# Altium schematic sheet ESP-WROOM32.SchDoc (part 2 of 3)
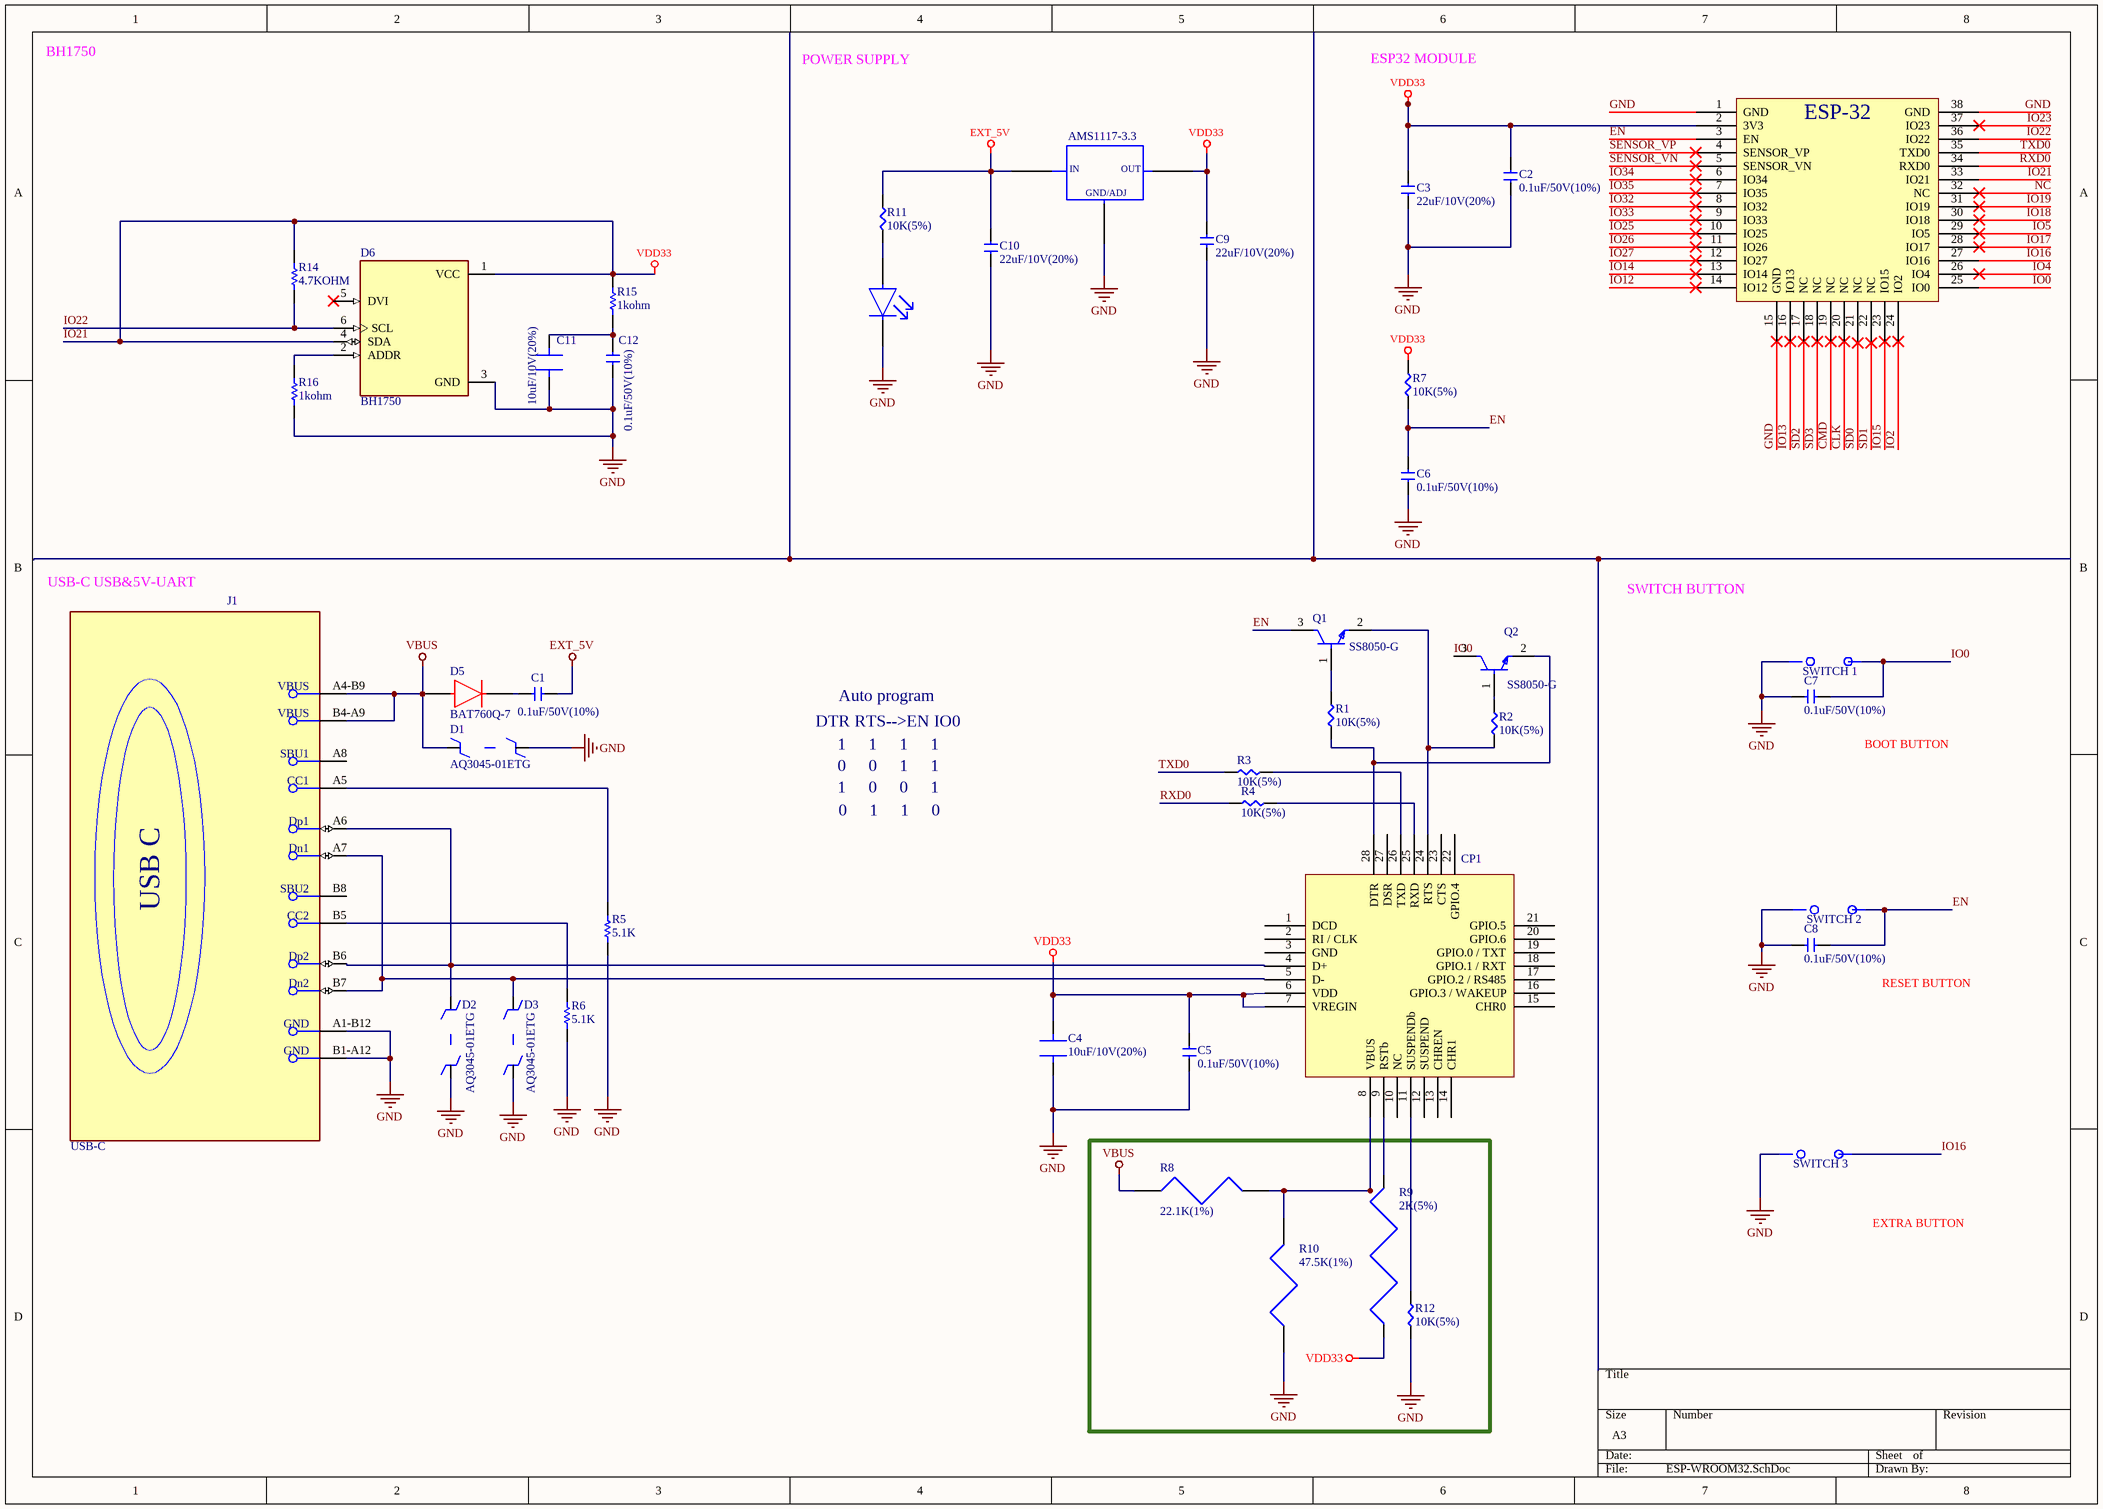
[diagram p1: ESP-WROOM32.SchDoc]
## Library data of the parts
*1 = ESP32-WROOM-32E-N4: RF TXRX MOD BT WIFI TH SMD; Manufacturer: Espressif Systems; Max Supply Voltage: 3.6V; Min Supply Voltage: 3V; Operating Supply Voltage: 3.3V; Supplier: DigiKey; Supplier Part Number: 1965-ESP32-WROOM-32E-N4CT-ND; Manufacturer Part Number: ESP32-WROOM-32E-N4; RoHS: Compliant; Category: System on Chip (SoC); Stock: 16186; Pricing: 1=4.84, 10=4.189, 25=3.9612, 100=3.649, 250=3.46184 (USD); Height - Seated (Max): 3.25mm; Length: 25.5mm; Max Operating Temperature: 85°C; Min Operating Temperature: -40°C; Number of Terminals: 38; Terminal Pitch: 1.27mm; Width: 18mm; ComponentLink1URL: https://datasheet.octopart.com:443/ESP32-WROOM-32E-N4-Espressif-Systems-datasheet-182247776.pdf?src-supplier=IHS; ComponentLink1Description: https://datasheet.octopart.com:443/ESP32-WROOM-32E-N4-Espressif-Systems-datasheet-182247776.pdf?src-supplier=IHS; ComponentLink2URL: https://datasheet.octopart.com:443/ESP32-WROOM-32E-N4-Espressif-Systems-datasheet-188867343.pdf?src-supplier=TME; ComponentLink2Description: https://datasheet.octopart.com:443/ESP32-WROOM-32E-N4-Espressif-Systems-datasheet-188867343.pdf?src-supplier=TME; ComponentLink3URL: https://datasheet.octopart.com:443/ESP32-WROOM-32E-N4-Espressif-Systems-datasheet-165560559.pdf?src-supplier=TME; ComponentLink3Description: https://datasheet.octopart.com:443/ESP32-WROOM-32E-N4-Espressif-Systems-datasheet-165560559.pdf?src-supplier=TME; ComponentLink4URL: https://datasheet.octopart.com:443/ESP32-WROOM-32E-N4-Espressif-Systems-datasheet-151884363.pdf?src-supplier=Future+Electronics; ComponentLink4Description: https://datasheet.octopart.com:443/ESP32-WROOM-32E-N4-Espressif-Systems-datasheet-151884363.pdf?src-supplier=Future+Electronics; LCSC part number: C701341
C1 C2 C5-C8 C12 = CL05B104KB5NNWC: CAP CER 0.1UF 50V X7R 0402; Manufacturer: Samsung Electro-Mechanics; Value: 100nF; Dielectric Material: Ceramic; Supplier: DigiKey; Supplier Part Number: 1276-CL05B104KB5NNWCCT-ND; Manufacturer Part Number: CL05B104KB5NNWC; RoHS: Compliant; Category: Ceramic Capacitors; Stock: 89724; Pricing: 1=0.1, 10=0.054, 50=0.037, 100=0.0319, 500=0.02338, 1000=0.02075, 2500=0.018, 5000=0.01634 (USD); China RoHS: Compliant; Lifecycle Status: Production; Max Operating Temperature: 125°C; Min Operating Temperature: -55°C; Mounting Technology: Surface Mount; Number of Terminals: 2; REACH SVHC: Yes; Schedule B: 8532240020, 8532240020|8532240020|8532240020|8532240020|8532240020; Voltage Rating (DC): 50V; ComponentLink1URL: https://datasheet.octopart.com:443/CL05B104KB5NNWC-Samsung-Electro-Mechanics-datasheet-182018729.pdf?src-supplier=IHS; ComponentLink1Description: https://datasheet.octopart.com:443/CL05B104KB5NNWC-Samsung-Electro-Mechanics-datasheet-182018729.pdf?src-supplier=IHS; LCSC part number: C7229230
C3 C9 C10 = GRM158R61A226ME15D: CAP CER 22UF 10V X5R 0402; Manufacturer: Murata; Manufacturer Lifecycle Status: IN PRODUCTION; Value: 22µF; Dielectric Material: Ceramic; Supplier: DigiKey; Supplier Part Number: 490-GRM158R61A226ME15DCT-ND; Manufacturer Part Number: GRM158R61A226ME15D; RoHS: Compliant; Category: Ceramic Capacitors; Stock: 340623; Pricing: 1=0.41, 10=0.247, 50=0.1828, 100=0.1632, 500=0.1301, 1000=0.1199, 2500=0.10912 (USD); Case/Package: 0402; Dielectric: X5R; Height: 800µm; Length: 1mm; Lifecycle Status: Production; Material: Ceramic; Max Operating Temperature: 85°C; Min Operating Temperature: -55°C; Mounting Technology: Surface Mount; Number of Terminals: 2; REACH SVHC: Yes; Thickness: 800µm; Tolerance: 20%; Voltage Rating: 10V; Voltage Rating (DC): 10V; Width: 500µm; ComponentLink1URL: https://datasheet.octopart.com:443/GRM158R61A226ME15D-Murata-datasheet-165579666.pdf?src-supplier=TME; ComponentLink1Description: https://datasheet.octopart.com:443/GRM158R61A226ME15D-Murata-datasheet-165579666.pdf?src-supplier=TME; ComponentLink2URL: https://datasheet.octopart.com/GRM158R61A226ME15D-Murata-datasheet-12515295.pdf; ComponentLink2Description: https://datasheet.octopart.com/GRM158R61A226ME15D-Murata-datasheet-12515295.pdf; ComponentLink3URL: https://datasheet.octopart.com/GRM158R61A226ME15D-Murata-datasheet-12510076.pdf; ComponentLink3Description: https://datasheet.octopart.com/GRM158R61A226ME15D-Murata-datasheet-12510076.pdf; ComponentLink4URL: https://datasheet.octopart.com/GRM158R61A226ME15D-Murata-datasheet-11978611.pdf; ComponentLink4Description: https://datasheet.octopart.com/GRM158R61A226ME15D-Murata-datasheet-11978611.pdf; ComponentLink5URL: https://datasheet.octopart.com/GRM158R61A226ME15D-Murata-datasheet-10025737.pdf; ComponentLink5Description: https://datasheet.octopart.com/GRM158R61A226ME15D-Murata-datasheet-10025737.pdf; ComponentLink6URL: https://datasheet.octopart.com/GRM158R61A226ME15D-Murata-datasheet-8819587.pdf; ComponentLink6Description: https://datasheet.octopart.com/GRM158R61A226ME15D-Murata-datasheet-8819587.pdf; ComponentLink7URL: http://sigma.octopart.com:80/reach_statement/Murata-company-16.pdf?src-supplier=Compliance+Statements; ComponentLink7Description: http://sigma.octopart.com:80/reach_statement/Murata-company-16.pdf?src-supplier=Compliance+Statements; LCSC part number: C3845593
C4 C11 = CC0402MRX5R6BB106: CAP CER 10UF 10V X5R 0402; Manufacturer: Yageo Group; Value: 10µF; Dielectric Material: Ceramic; Supplier: DigiKey; Supplier Part Number: 13-CC0402MRX5R6BB106CT-ND; Manufacturer Part Number: CC0402MRX5R6BB106; RoHS: Compliant; Category: Ceramic Capacitors; Stock: 59624; Pricing: 1=0.21, 10=0.121, 50=0.0866, 100=0.076, 500=0.05824, 1000=0.05277, 2500=0.04701, 5000=0.04354 (USD); Case/Package: 0402; China RoHS: Compliant; Dielectric: X5R; Halogen Free: Halogen Free; Height: 500µm; Lead Free: Lead Free; Length: 1mm; Lifecycle Status: Production; Max Operating Temperature: 85°C; Min Operating Temperature: -55°C; Mounting Technology: Surface Mount; Number of Terminals: 2; REACH SVHC: Yes; Voltage Rating (DC): 10V; Width: 500µm; ComponentLink1URL: https://datasheet.octopart.com:443/CC0402MRX5R6BB106-Yageo-datasheet-170350636.pdf?src-supplier=IHS; ComponentLink1Description: https://datasheet.octopart.com:443/CC0402MRX5R6BB106-Yageo-datasheet-170350636.pdf?src-supplier=IHS; ComponentLink2URL: https://datasheet.octopart.com:443/CC0402MRX5R6BB106-Yageo-Group-datasheet-189192896.pdf?src-supplier=TME; ComponentLink2Description: https://datasheet.octopart.com:443/CC0402MRX5R6BB106-Yageo-Group-datasheet-189192896.pdf?src-supplier=TME; ComponentLink3URL: https://datasheet.octopart.com:443/CC0402MRX5R6BB106-Yageo-datasheet-182029486.pdf?src-supplier=Newark; ComponentLink3Description: https://datasheet.octopart.com:443/CC0402MRX5R6BB106-Yageo-datasheet-182029486.pdf?src-supplier=Newark; ComponentLink4URL: https://datasheet.octopart.com:443/CC0402MRX5R6BB106-Yageo-datasheet-158238148.pdf?src-supplier=Newark; ComponentLink4Description: https://datasheet.octopart.com:443/CC0402MRX5R6BB106-Yageo-datasheet-158238148.pdf?src-supplier=Newark; ComponentLink5URL: https://datasheet.octopart.com/CC0402MRX5R6BB106-Yageo-datasheet-86397281.pdf; ComponentLink5Description: https://datasheet.octopart.com/CC0402MRX5R6BB106-Yageo-datasheet-86397281.pdf; ComponentLink6URL: https://datasheet.octopart.com:443/CC0402MRX5R6BB106-Yageo-datasheet-175963154.pdf?src-supplier=element14+APAC; ComponentLink6Description: https://datasheet.octopart.com:443/CC0402MRX5R6BB106-Yageo-datasheet-175963154.pdf?src-supplier=element14+APAC; ComponentLink7URL: https://datasheet.octopart.com:443/CC0402MRX5R6BB106-Yageo-Group-datasheet-145016144.pdf?src-supplier=ODG+(Origin+Data+Global); ComponentLink7Description: https://datasheet.octopart.com:443/CC0402MRX5R6BB106-Yageo-Group-datasheet-145016144.pdf?src-supplier=ODG+(Origin+Data+Global); ComponentLink8URL: https://datasheet.octopart.com:443/CC0402MRX5R6BB106-Yageo-datasheet-62067349.pdf?src-supplier=Future+Electronics; ComponentLink8Description: https://datasheet.octopart.com:443/CC0402MRX5R6BB106-Yageo-datasheet-62067349.pdf?src-supplier=Future+Electronics; ComponentLink9URL: http://sigma.octopart.com:80/conflict_mineral_statement/Yageo-company-3.pdf?src-supplier=Compliance+Statements; ComponentLink9Description: http://sigma.octopart.com:80/conflict_mineral_statement/Yageo-company-3.pdf?src-supplier=Compliance+Statements; ComponentLink10URL: http://sigma.octopart.com:80/rohs_statement/Yageo-company-2.pdf?src-supplier=Compliance+Statements; ComponentLink10Description: http://sigma.octopart.com:80/rohs_statement/Yageo-company-2.pdf?src-supplier=Compliance+Statements; LCSC PART NUMBER: C962143
CP1 = CP2102N-A02-GQFN28: USB Bridge, USB to UART USB 2.0 UART Interface 28-QFN (5x5); Manufacturer: Silicon Labs; Manufacturer Lifecycle Status: FULL PRODUCTION; Data Rate: 1.5Mbps; Max Junction Temperature (Tj): 105°C; Max Supply Voltage: 3.6V; Min Supply Voltage: 3V; Number of Digital IO: 7; Number of Ports: 1; Operating Supply Voltage: 3.3V; USB Standard: USB 2.0; Supplier: DigiKey; Supplier Part Number: 336-5889-ND; Manufacturer Part Number: CP2102N-A02-GQFN28; RoHS: Compliant; Category: USB Interface ICs; Stock: 1307; Pricing: 1=4.32, 10=3.275, 73=2.78205, 146=2.66534, 292=2.56928, 511=2.50429, 1022=2.43673, 2555=2.36542 (USD); Ambient Temperature Range High: 85°C; China RoHS: Compliant; Height: 800µm; Height - Seated (Max): 800µm; Interface: UART; Length: 5mm; Lifecycle Status: Production; Max Operating Temperature: 85°C; Min Operating Temperature: -40°C; Number of Terminals: 28; REACH SVHC: Yes; Terminal Pitch: 500µm; Width: 5mm; ComponentLink1URL: https://datasheet.octopart.com:443/CP2102N-A02-GQFN28-Silicon-Labs-datasheet-138898368.pdf?src-supplier=Augswan; ComponentLink1Description: https://datasheet.octopart.com:443/CP2102N-A02-GQFN28-Silicon-Labs-datasheet-138898368.pdf?src-supplier=Augswan; ComponentLink2URL: https://datasheet.octopart.com:443/CP2102N-A02-GQFN28-Silicon-Labs-datasheet-166051788.pdf?src-supplier=IHS; ComponentLink2Description: https://datasheet.octopart.com:443/CP2102N-A02-GQFN28-Silicon-Labs-datasheet-166051788.pdf?src-supplier=IHS; LCSC PART NUMBER: C964632
D1-D3 = AQ3045-01ETG: TVS DIODE 5.3VWM 12VC SOD882; Manufacturer: Littelfuse; Breakdown Voltage: 7.8V; Clamping Voltage: 12V; Leakage Current: 100nA; Max Breakdown Voltage: 9V; Min Breakdown Voltage: 6.8V; Number of Channels: 1; Operating Supply Voltage: 5.3V; Peak Pulse Power: 40W; Polarity: Bidirectional; Supplier: Arrow Electronics; Supplier Part Number: AQ3045-01ETG; Manufacturer Part Number: AQ3045-01ETG; RoHS: Compliant; Category: TVS Diodes; Stock: 250000; Pricing: 10000=0.1196 (USD); Lifecycle Status: Production; Max Operating Temperature: 150°C; Min Operating Temperature: -40°C; Mounting Technology: Surface Mount; Number of Elements: 1; Number of Terminals: 2; Packaging: Cut Tape; Peak Reverse Current: 100nA; REACH SVHC: Yes; Reverse Standoff Voltage: 5.3V; ComponentLink1URL: https://datasheet.octopart.com:443/AQ3045-01ETG-Littelfuse-datasheet-180606588.pdf?src-supplier=IHS; ComponentLink1Description: https://datasheet.octopart.com:443/AQ3045-01ETG-Littelfuse-datasheet-180606588.pdf?src-supplier=IHS; ComponentLink2URL: https://datasheet.octopart.com:443/AQ3045-01ETG-Littelfuse-datasheet-183003566.pdf?src-supplier=JRH+Electronics; ComponentLink2Description: https://datasheet.octopart.com:443/AQ3045-01ETG-Littelfuse-datasheet-183003566.pdf?src-supplier=JRH+Electronics; ComponentLink3URL: https://datasheet.octopart.com:443/AQ3045-01ETG-Littelfuse-datasheet-140480283.pdf?src-supplier=ODG+(Origin+Data+Global); ComponentLink3Description: https://datasheet.octopart.com:443/AQ3045-01ETG-Littelfuse-datasheet-140480283.pdf?src-supplier=ODG+(Origin+Data+Global); ComponentLink4URL: https://datasheet.octopart.com:443/AQ3045-01ETG-Littelfuse-datasheet-101609968.pdf?src-supplier=Farnell; ComponentLink4Description: https://datasheet.octopart.com:443/AQ3045-01ETG-Littelfuse-datasheet-101609968.pdf?src-supplier=Farnell; ComponentLink5URL: https://datasheet.octopart.com:443/AQ3045-01ETG-Littelfuse-datasheet-170904929.pdf?src-supplier=Future+Electronics; ComponentLink5Description: https://datasheet.octopart.com:443/AQ3045-01ETG-Littelfuse-datasheet-170904929.pdf?src-supplier=Future+Electronics; LCSC PART NUMBER: C3710326
D4 = LTST-C170GKT: LED GREEN CLEAR SMD; Manufacturer: Lite-On; Current: 4A; Dominant Wavelength: 569nm; Forward Current: 30mA; Forward Voltage: 2.6V; Lens Color: Clear, Colorless; Luminous Intensity: 6mcd; Number of Circuits: 1; Peak Wavelength: 565nm; Power Dissipation: 100mW; Reverse Voltage: 5V; Shape: Rectangular; Test Current: 10mA; Viewing Angle: 130°; Supplier: DigiKey; Supplier Part Number: 160-1179-1-ND; Manufacturer Part Number: LTST-C170GKT; RoHS: Compliant; Category: LEDs; Stock: 1226220; Pricing: 1=0.1, 10=0.066, 100=0.0453, 500=0.03552, 1000=0.03224 (USD); Case/Package: 0805; Case Code (Imperial): 0805; Case Code (Metric): 2012; China RoHS: Compliant; Color: Green; Depth: 1.25mm; Height: 1.1mm; Illumination Color: Green; Lead Free: Lead Free; Length: 2mm; Lens Transparency: Clear; Lifecycle Status: Production; Max Operating Temperature: 85°C; Min Operating Temperature: -55°C; Mounting Technology: Surface Mount; Number of Elements: 1; Number of LEDs: 1; Pins: 2; Number of Terminals: 2; Packaging: Tape and Reel; Power Rating: 100mW; Radiation Hardening: No; REACH SVHC: Yes; Schedule B: 8541402000, 8541402000|8541402000|8541402000|8541402000|8541402000|8541402000|8541402000|8541402000|8541402000|8541402000|8541402000|8541402000|8541402000|8541402000|8541402000|8541402000|8541402000|8541402000|8541402000|8541402000|8541402000|8541402000|8541402000|85; Terminal Pitch: 2.1mm; Voltage: 5V; Wavelength: 569nm; Width: 1.25mm; ComponentLink1URL: https://datasheet.octopart.com:443/LTST-C170GKT-Lite-On-datasheet-180605137.pdf?src-supplier=IHS; ComponentLink1Description: https://datasheet.octopart.com:443/LTST-C170GKT-Lite-On-datasheet-180605137.pdf?src-supplier=IHS; ComponentLink2URL: https://datasheet.octopart.com:443/LTST-C170GKT-Lite-On-datasheet-141439001.pdf?src-supplier=Upverter; ComponentLink2Description: https://datasheet.octopart.com:443/LTST-C170GKT-Lite-On-datasheet-141439001.pdf?src-supplier=Upverter; ComponentLink3URL: https://datasheet.octopart.com:443/LTST-C170GKT-Lite-On-datasheet-159307.pdf?src-supplier=Arrow+Electronics; ComponentLink3Description: https://datasheet.octopart.com:443/LTST-C170GKT-Lite-On-datasheet-159307.pdf?src-supplier=Arrow+Electronics; ComponentLink4URL: https://datasheet.octopart.com:443/LTST-C170GKT-Lite-On-datasheet-8330158.pdf?src-supplier=TME; ComponentLink4Description: https://datasheet.octopart.com:443/LTST-C170GKT-Lite-On-datasheet-8330158.pdf?src-supplier=TME; ComponentLink5URL: https://datasheet.octopart.com:443/LTST-C170GKT-Lite-On-datasheet-26684672.pdf?src-supplier=Future+Electronics; ComponentLink5Description: https://datasheet.octopart.com:443/LTST-C170GKT-Lite-On-datasheet-26684672.pdf?src-supplier=Future+Electronics; ComponentLink6URL: https://datasheet.octopart.com:443/LTST-C170GKT-Lite-On-datasheet-59241.pdf?src-supplier=DigiKey; ComponentLink6Description: https://datasheet.octopart.com:443/LTST-C170GKT-Lite-On-datasheet-59241.pdf?src-supplier=DigiKey; ComponentLink7URL: https://datasheet.octopart.com:443/LTST-C170GKT-Lite-On-datasheet-14174986.pdf?src-supplier=iiiC; ComponentLink7Description: https://datasheet.octopart.com:443/LTST-C170GKT-Lite-On-datasheet-14174986.pdf?src-supplier=iiiC; LCSC PART NUMBER: C125090
D5 = BAT760Q-7: DIODE SCHOTTKY 30V 1A SOD323; Manufacturer: Diodes Inc.; Max Forward Surge Current (Ifsm): 5.5A; Max Power Dissipation: 235mW; Number of Elements: 1; Supplier: DigiKey; Supplier Part Number: BAT760Q-7DICT-ND; Manufacturer Part Number: BAT760Q-7; RoHS: Compliant; Category: Schottky Diodes; Stock: 16229; Pricing: 1=0.3, 10=0.205, 100=0.1688, 500=0.12602, 1000=0.11219 (USD); Average Rectified Current: 1A; China RoHS: Compliant; Lifecycle Status: Production; Max Operating Temperature: 150°C; Max Output current: 1A; Max Reverse Voltage (DC): 30V; Min Operating Temperature: -65°C; Mounting Technology: Surface Mount; Number of Terminals: 2; REACH SVHC: Yes; Reverse Standoff Voltage: 30V; Schedule B: 8541100080, 8541100080|8541100080|8541100080|8541100080|8541100080; ComponentLink1URL: https://datasheet.octopart.com:443/BAT760Q-7-Diodes-Inc.-datasheet-151209907.pdf?src-supplier=IHS; ComponentLink1Description: https://datasheet.octopart.com:443/BAT760Q-7-Diodes-Inc.-datasheet-151209907.pdf?src-supplier=IHS; ComponentLink2URL: https://sigma.octopart.com:443/138810740/technical_drawing/Diodes-Inc.-BAT760Q-7.pdf?src-supplier=Diodes+Inc+SCT; ComponentLink2Description: https://sigma.octopart.com:443/138810740/technical_drawing/Diodes-Inc.-BAT760Q-7.pdf?src-supplier=Diodes+Inc+SCT; lcsc part number: C3759252
D6 = BH1750FVI-TR: SENSOR OPT 560NM AMBIENT 6WSOF; Manufacturer: ROHM; Interface: I2C, Serial; Clock Frequency: 400kHz; Max Power Dissipation: 260mW; Max Supply Voltage: 3.6V; Min Supply Voltage: 2.4V; Number of Circuits: 1; Operating Supply Current: 120µA; Operating Supply Voltage: 3V; Output Type: Digital, I2C; Sensing Method: Optical; Type: Integrated Circuit (IC); Supplier: DigiKey; Supplier Part Number: BH1750FVICT-ND; Manufacturer Part Number: BH1750FVI-TR; RoHS: Compliant; Category: Optical Sensors; Stock: 3509; Pricing: 1=3.29, 5=2.934, 10=2.804, 25=2.648, 50=2.542, 100=2.4447, 500=2.24896, 1000=2.18484 (USD); Case/Package: SMD/SMT; Contact Plating: Copper, Tin; Height: 750µm; Height - Seated (Max): 750µm; Lead Free: Lead Free; Length: 2.6mm; Lifecycle Status: Obsolete; Max Operating Temperature: 85°C; Min Operating Temperature: -40°C; Mounting Technology: Surface Mount; Pins: 6; Number of Terminals: 6; Radiation Hardening: No; REACH SVHC: Yes; Schedule B: 8541409500; Terminal Pitch: 500µm; Wavelength: 560nm; Width: 1.6mm; ComponentLink1URL: https://sigma.octopart.com:443/169791153/technical_drawing/ROHM-BH1750FVI-TR.pdf?src-supplier=Upverter; ComponentLink1Description: https://sigma.octopart.com:443/169791153/technical_drawing/ROHM-BH1750FVI-TR.pdf?src-supplier=Upverter; ComponentLink2URL: https://datasheet.octopart.com:443/BH1750FVI-TR-Rohm-datasheet-141422541.pdf?src-supplier=Upverter; ComponentLink2Description: https://datasheet.octopart.com:443/BH1750FVI-TR-Rohm-datasheet-141422541.pdf?src-supplier=Upverter; ComponentLink3URL: https://datasheet.octopart.com:443/BH1750FVI-TR-ROHM-datasheet-169791149.pdf?src-supplier=Upverter; ComponentLink3Description: https://datasheet.octopart.com:443/BH1750FVI-TR-ROHM-datasheet-169791149.pdf?src-supplier=Upverter; ComponentLink4URL: https://datasheet.octopart.com:443/BH1750FVI-TR-Rohm-datasheet-25365051.pdf?src-supplier=Newark; ComponentLink4Description: https://datasheet.octopart.com:443/BH1750FVI-TR-Rohm-datasheet-25365051.pdf?src-supplier=Newark; ComponentLink5URL: https://datasheet.octopart.com:443/BH1750FVI-TR-Rohm-datasheet-8331172.pdf?src-supplier=_legacy+Avnet; ComponentLink5Description: https://datasheet.octopart.com:443/BH1750FVI-TR-Rohm-datasheet-8331172.pdf?src-supplier=_legacy+Avnet; ComponentLink6URL: https://datasheet.octopart.com:443/BH1750FVI-TR-Rohm-datasheet-145014626.pdf?src-supplier=Future+Electronics; ComponentLink6Description: https://datasheet.octopart.com:443/BH1750FVI-TR-Rohm-datasheet-145014626.pdf?src-supplier=Future+Electronics; ComponentLink7URL: https://datasheet.octopart.com:443/BH1750FVI-TR-Rohm-datasheet-14434783.pdf?src-supplier=Factory+Futures; ComponentLink7Description: https://datasheet.octopart.com:443/BH1750FVI-TR-Rohm-datasheet-14434783.pdf?src-supplier=Factory+Futures; LCSC PART NUMBER: C78960
J1 = 2171790001: CONN RCP USB2.0 TYP C 24P SMD RA; Manufacturer: Molex; Manufacturer Part Number: 217179-0001; Contact Resistance: 50mΩ; Current Rating: 1.25A; Dielectric Material: Polyamide; Gender: Receptacle; Insulation Resistance: 100MΩ; Number of Contacts: 16; Number of Ports: 1; Voltage Rating: 30V; Supplier: DigiKey; Supplier Part Number: 900-2171790001CT-ND; RoHS: Compliant; Category: USB Connectors; Stock: 5295; Pricing: 1=0.83, 10=0.704, 25=0.6596, 50=0.628, 100=0.598, 250=0.56052, 500=0.53374 (USD); Contact Gender: Female; Contact Material: Gold, Nickel; Height: 3.36mm; Lifecycle Status: Production; Max Operating Temperature: 85°C; Min Operating Temperature: -40°C; Pins: 16; Number of Rows: 1; REACH SVHC: Yes; Shell Finish: Nickel; Shell Material: Stainless Steel; Terminal Pitch: 500µm; USB Standard: USB 2.0; ComponentLink1URL: https://datasheet.octopart.com:443/217179-0001-Molex-datasheet-158871109.pdf?src-supplier=ODG+(Origin+Data+Global); ComponentLink1Description: https://datasheet.octopart.com:443/217179-0001-Molex-datasheet-158871109.pdf?src-supplier=ODG+(Origin+Data+Global); ComponentLink2URL: https://sigma.octopart.com:443/158871110/technical_drawing/Molex-217179-0001.pdf?src-supplier=Upverter; ComponentLink2Description: https://sigma.octopart.com:443/158871110/technical_drawing/Molex-217179-0001.pdf?src-supplier=Upverter; ComponentLink3URL: https://datasheet.octopart.com:443/217179-0001-Molex-datasheet-164573281.pdf?src-supplier=RS+(Formerly+Allied+Electronics); ComponentLink3Description: https://datasheet.octopart.com:443/217179-0001-Molex-datasheet-164573281.pdf?src-supplier=RS+(Formerly+Allied+Electronics); ComponentLink4URL: http://sigma.octopart.com:80/conflict_mineral_statement/Molex-company-72.pdf?src-supplier=Compliance+Statements; ComponentLink4Description: http://sigma.octopart.com:80/conflict_mineral_statement/Molex-company-72.pdf?src-supplier=Compliance+Statements; ComponentLink5URL: http://sigma.octopart.com:80/rohs_statement/Molex-company-73.pdf?src-supplier=Compliance+Statements; ComponentLink5Description: http://sigma.octopart.com:80/rohs_statement/Molex-company-73.pdf?src-supplier=Compliance+Statements; ComponentLink6URL: http://sigma.octopart.com:80/reach_statement/Molex-company-74.pdf?src-supplier=Compliance+Statements; ComponentLink6Description: http://sigma.octopart.com:80/reach_statement/Molex-company-74.pdf?src-supplier=Compliance+Statements; LCSC PART NUMBER: C3197684
Q1 Q2 = SS8050-G: TRANS NPN 25V 1.5A SOT-23-3; Manufacturer: Comchip; Collector Base Voltage (VCBO): 40V; Collector Emitter Saturation Voltage: 500mV; Emitter Base Voltage (VEBO): 5V; hFE Min: 40; Max Junction Temperature (Tj): 150°C; Max Power Dissipation: 300mW; Number of Elements: 1; Transition Frequency: 100MHz; Supplier: DigiKey; Supplier Part Number: 641-1790-1-ND; Manufacturer Part Number: SS8050-G; RoHS: Compliant; Category: BJTs; Stock: 59487; Pricing: 1=0.24, 10=0.148, 100=0.0921, 500=0.06754, 1000=0.05958 (USD); Case/Package: TO-236-3; Collector Emitter Breakdown Voltage: 25V; Collector Emitter Voltage (VCEO): 25V; Height: 1.15mm; Lifecycle Status: Production; Max Breakdown Voltage: 25V; Max Collector Current: 1.5A; Max Operating Temperature: 150°C; Mounting Technology: Surface Mount; Number of Terminals: 3; Power Dissipation: 300mW; REACH SVHC: Yes; Schedule B: 8541100070|8541100070|8541100070|8541100070|8541100070; ComponentLink1URL: https://datasheet.octopart.com:443/SS8050-G-Comchip-datasheet-180131983.pdf?src-supplier=IHS; ComponentLink1Description: https://datasheet.octopart.com:443/SS8050-G-Comchip-datasheet-180131983.pdf?src-supplier=IHS; ComponentLink2URL: https://datasheet.octopart.com:443/SS8050-G-Comchip-datasheet-155422643.pdf?src-supplier=Upverter; ComponentLink2Description: https://datasheet.octopart.com:443/SS8050-G-Comchip-datasheet-155422643.pdf?src-supplier=Upverter; ComponentLink3URL: https://datasheet.octopart.com:443/SS8050-G-Comchip-datasheet-189767092.pdf?src-supplier=ODG+(Origin+Data+Global); ComponentLink3Description: https://datasheet.octopart.com:443/SS8050-G-Comchip-datasheet-189767092.pdf?src-supplier=ODG+(Origin+Data+Global); LCSC PART NUMBER: C164886
R1-R4 R7 R11 R12 = RC0402JR-0710KL: RES 10K OHM 5% 1/16W 0402; Manufacturer: Yageo Group; Max Power Dissipation: 63mW; Power Dissipation: 62.5mW; Value: 10kΩ; Temperature Coefficient: 100ppm/°C; Voltage Rating: 50V; Supplier: DigiKey; Supplier Part Number: 311-10KJRCT-ND; Manufacturer Part Number: RC0402JR-0710KL; RoHS: Compliant; Category: Chip SMD Resistors; Stock: 11539169; Pricing: 1=0.1, 10=0.006, 25=0.0056, 50=0.0052, 100=0.0046, 250=0.00416, 500=0.00284 (USD); Case/Package: 0402; Case Code (Imperial): 0402; China RoHS: Non-Compliant; Composition: Thick Film; Depth: 500µm; Features: Moisture Resistant; Height: 350µm; Lead Free: Lead Free; Length: 1mm; Lifecycle Status: Production; Max Operating Temperature: 155°C; Military Standard: Not; Min Operating Temperature: -55°C; Mounting Technology: Surface Mount; Pins: 2; Number of Terminals: 2; Number of Terminations: 2; Packaging: Tape & Reel; Power Rating: 62.5mW; REACH SVHC: Yes; Schedule B: 8533210045, 8533210045|8533210045, 8533210045|8533210045|8533210045, 8533210045|8533210045|8533210045|8533210045; Termination: SMD/SMT; Tolerance: 5%; Voltage Rating (AC): 50V; Voltage Rating (DC): 50V; Width: 500µm; Working Voltage: 50V; ComponentLink1URL: https://datasheet.octopart.com:443/RC0402JR-0710KL-Yageo-datasheet-175887523.pdf?src-supplier=IHS; ComponentLink1Description: https://datasheet.octopart.com:443/RC0402JR-0710KL-Yageo-datasheet-175887523.pdf?src-supplier=IHS; ComponentLink2URL: https://datasheet.octopart.com:443/RC0402JR-0710KL-Yageo-datasheet-10408619.pdf?src-supplier=Newark; ComponentLink2Description: https://datasheet.octopart.com:443/RC0402JR-0710KL-Yageo-datasheet-10408619.pdf?src-supplier=Newark; ComponentLink3URL: https://datasheet.octopart.com:443/RC0402JR-0710KL-Yageo-datasheet-505231.pdf?src-supplier=Newark; ComponentLink3Description: https://datasheet.octopart.com:443/RC0402JR-0710KL-Yageo-datasheet-505231.pdf?src-supplier=Newark; ComponentLink4URL: https://datasheet.octopart.com:443/RC0402JR-0710KL-Yageo-datasheet-141265859.pdf?src-supplier=Upverter; ComponentLink4Description: https://datasheet.octopart.com:443/RC0402JR-0710KL-Yageo-datasheet-141265859.pdf?src-supplier=Upverter; ComponentLink5URL: https://sigma.octopart.com:443/138820526/technical_drawing/Yageo-RC0402JR-0710KL.pdf?src-supplier=Upverter; ComponentLink5Description: https://sigma.octopart.com:443/138820526/technical_drawing/Yageo-RC0402JR-0710KL.pdf?src-supplier=Upverter; ComponentLink6URL: https://datasheet.octopart.com:443/RC0402JR-0710KL-Yageo-datasheet-62067350.pdf?src-supplier=Farnell; ComponentLink6Description: https://datasheet.octopart.com:443/RC0402JR-0710KL-Yageo-datasheet-62067350.pdf?src-supplier=Farnell; ComponentLink7URL: https://datasheet.octopart.com:443/RC0402JR-0710KL-Yageo-datasheet-12531192.pdf?src-supplier=Seeed+Studio; ComponentLink7Description: https://datasheet.octopart.com:443/RC0402JR-0710KL-Yageo-datasheet-12531192.pdf?src-supplier=Seeed+Studio; ComponentLink8URL: https://datasheet.octopart.com:443/RC0402JR-0710KL-Yageo-datasheet-8324527.pdf?src-supplier=TME; ComponentLink8Description: https://datasheet.octopart.com:443/RC0402JR-0710KL-Yageo-datasheet-8324527.pdf?src-supplier=TME; ComponentLink9URL: https://datasheet.octopart.com:443/RC0402JR-0710KL-Yageo-datasheet-164759695.pdf?src-supplier=Future+Electronics; ComponentLink9Description: https://datasheet.octopart.com:443/RC0402JR-0710KL-Yageo-datasheet-164759695.pdf?src-supplier=Future+Electronics; ComponentLink10URL: https://datasheet.octopart.com:443/RC0402JR-0710KL-Yageo-datasheet-137700087.pdf?src-supplier=Future+Electronics; ComponentLink10Description: https://datasheet.octopart.com:443/RC0402JR-0710KL-Yageo-datasheet-137700087.pdf?src-supplier=Future+Electronics; ComponentLink11URL: https://datasheet.octopart.com/RC0402JR-0710KL-Yageo-datasheet-73766026.pdf; ComponentLink11Description: https://datasheet.octopart.com/RC0402JR-0710KL-Yageo-datasheet-73766026.pdf; ComponentLink12URL: https://datasheet.octopart.com:443/RC0402JR-0710KL-Yageo-datasheet-8329306.pdf?src-supplier=element14; ComponentLink12Description: https://datasheet.octopart.com:443/RC0402JR-0710KL-Yageo-datasheet-8329306.pdf?src-supplier=element14; ComponentLink13URL: http://sigma.octopart.com:80/rohs_statement/Yageo-company-2.pdf?src-supplier=Compliance+Statements; ComponentLink13Description: http://sigma.octopart.com:80/rohs_statement/Yageo-company-2.pdf?src-supplier=Compliance+Statements; ComponentLink14URL: http://sigma.octopart.com:80/conflict_mineral_statement/Yageo-company-3.pdf?src-supplier=Compliance+Statements; ComponentLink14Description: http://sigma.octopart.com:80/conflict_mineral_statement/Yageo-company-3.pdf?src-supplier=Compliance+Statements; LCSC part number: C60489
R5 R6 = RC0402FR-075K1L: RES 5.1K OHM 1% 1/16W 0402; Manufacturer: Yageo Group; Max Power Dissipation: 63mW; Power Dissipation: 62.5mW; Value: 5.1kΩ; Temperature Coefficient: 100ppm/°C; Voltage Rating: 50V; Supplier: DigiKey; Supplier Part Number: 311-5.10KLRCT-ND; Manufacturer Part Number: RC0402FR-075K1L; RoHS: Compliant; Category: Chip SMD Resistors; Stock: 251126; Pricing: 1=0.1, 10=0.008, 25=0.0072, 50=0.0062, 100=0.0056, 250=0.00308 (USD); Case/Package: 0402; Case Code (Imperial): 0402; China RoHS: Non-Compliant; Composition: Thick Film; Depth: 500µm; Features: Moisture Resistant; Height: 350µm; Lead Free: Lead Free; Length: 1mm; Lifecycle Status: Production; Max Operating Temperature: 155°C; Military Standard: Not; Min Operating Temperature: -55°C; Mounting Technology: Surface Mount; Pins: 2; Number of Terminals: 2; Number of Terminations: 2; Packaging: Cut Tape; Power Rating: 63mW; REACH SVHC: Yes; Schedule B: 8533210045, 8533210045|8533210045, 8533210045|8533210045|8533210045, 8533210045|8533210045|8533210045|8533210045; Termination: SMD/SMT; Tolerance: 1%; Voltage Rating (DC): 50V; Width: 500µm; Working Voltage: 50V; ComponentLink1URL: https://datasheet.octopart.com:443/RC0402FR-075K1L-Yageo-datasheet-175887523.pdf?src-supplier=IHS; ComponentLink1Description: https://datasheet.octopart.com:443/RC0402FR-075K1L-Yageo-datasheet-175887523.pdf?src-supplier=IHS; ComponentLink2URL: https://datasheet.octopart.com:443/RC0402FR-075K1L-Yageo-datasheet-103092701.pdf?src-supplier=Upverter; ComponentLink2Description: https://datasheet.octopart.com:443/RC0402FR-075K1L-Yageo-datasheet-103092701.pdf?src-supplier=Upverter; ComponentLink3URL: https://datasheet.octopart.com:443/RC0402FR-075K1L-Yageo-datasheet-10408619.pdf?src-supplier=Newark; ComponentLink3Description: https://datasheet.octopart.com:443/RC0402FR-075K1L-Yageo-datasheet-10408619.pdf?src-supplier=Newark; ComponentLink4URL: https://datasheet.octopart.com:443/RC0402FR-075K1L-Yageo-datasheet-8324527.pdf?src-supplier=Newark; ComponentLink4Description: https://datasheet.octopart.com:443/RC0402FR-075K1L-Yageo-datasheet-8324527.pdf?src-supplier=Newark; ComponentLink5URL: https://datasheet.octopart.com:443/RC0402FR-075K1L-Yageo-datasheet-62067350.pdf?src-supplier=element14+APAC; ComponentLink5Description: https://datasheet.octopart.com:443/RC0402FR-075K1L-Yageo-datasheet-62067350.pdf?src-supplier=element14+APAC; ComponentLink6URL: https://datasheet.octopart.com:443/RC0402FR-075K1L-Yageo-datasheet-164759695.pdf?src-supplier=Future+Electronics; ComponentLink6Description: https://datasheet.octopart.com:443/RC0402FR-075K1L-Yageo-datasheet-164759695.pdf?src-supplier=Future+Electronics; ComponentLink7URL: https://datasheet.octopart.com:443/RC0402FR-075K1L-Yageo-datasheet-137700087.pdf?src-supplier=Future+Electronics; ComponentLink7Description: https://datasheet.octopart.com:443/RC0402FR-075K1L-Yageo-datasheet-137700087.pdf?src-supplier=Future+Electronics; ComponentLink8URL: https://datasheet.octopart.com:443/RC0402FR-075K1L-Yageo-datasheet-12531192.pdf?src-supplier=Future+Electronics; ComponentLink8Description: https://datasheet.octopart.com:443/RC0402FR-075K1L-Yageo-datasheet-12531192.pdf?src-supplier=Future+Electronics; ComponentLink9URL: https://datasheet.octopart.com:443/RC0402FR-075K1L-Yageo-datasheet-505231.pdf?src-supplier=Future+Electronics; ComponentLink9Description: https://datasheet.octopart.com:443/RC0402FR-075K1L-Yageo-datasheet-505231.pdf?src-supplier=Future+Electronics; ComponentLink10URL: https://datasheet.octopart.com:443/RC0402FR-075K1L-Yageo-datasheet-148775077.pdf?src-supplier=TME; ComponentLink10Description: https://datasheet.octopart.com:443/RC0402FR-075K1L-Yageo-datasheet-148775077.pdf?src-supplier=TME; ComponentLink11URL: https://datasheet.octopart.com/RC0402FR-075K1L-Yageo-datasheet-73766026.pdf; ComponentLink11Description: https://datasheet.octopart.com/RC0402FR-075K1L-Yageo-datasheet-73766026.pdf; ComponentLink12URL: https://datasheet.octopart.com:443/RC0402FR-075K1L-Yageo-datasheet-8329306.pdf?src-supplier=element14; ComponentLink12Description: https://datasheet.octopart.com:443/RC0402FR-075K1L-Yageo-datasheet-8329306.pdf?src-supplier=element14; ComponentLink13URL: http://sigma.octopart.com:80/rohs_statement/Yageo-company-2.pdf?src-supplier=Compliance+Statements; ComponentLink13Description: http://sigma.octopart.com:80/rohs_statement/Yageo-company-2.pdf?src-supplier=Compliance+Statements; ComponentLink14URL: http://sigma.octopart.com:80/conflict_mineral_statement/Yageo-company-3.pdf?src-supplier=Compliance+Statements; ComponentLink14Description: http://sigma.octopart.com:80/conflict_mineral_statement/Yageo-company-3.pdf?src-supplier=Compliance+Statements; LCSC PART NUMBER: C105872
R8 = AC0402FR-0722K1L: RES SMD 22.1K OHM 1% 1/16W 0402; Manufacturer: Yageo Group; Max Power Dissipation: 63mW; Power Dissipation: 62.5mW; Value: 22.1kΩ; Temperature Coefficient: 100ppm/°C; Voltage Rating: 50V; Supplier: DigiKey; Supplier Part Number: YAG3457CT-ND; Manufacturer Part Number: AC0402FR-0722K1L; RoHS: Compliant; Category: Chip SMD Resistors; Stock: 23159; Pricing: 1=0.1, 10=0.009, 25=0.008, 50=0.0072, 100=0.0066, 250=0.00408, 500=0.00406 (USD); Case/Package: 0402; Case Code (Imperial): 0402; Case Code (Metric): 1005; China RoHS: Non-Compliant; Composition: Thick Film; Features: Automotive AEC-Q200, Moisture Resistant; Height: 320µm; Length: 990.6µm; Lifecycle Status: Production; Max Operating Temperature: 155°C; Min Operating Temperature: -55°C; Mounting Technology: Surface Mount; Number of Terminals: 2; Number of Terminations: 2; Packaging: Tape & Reel; Power Rating: 62.5mW; REACH SVHC: Yes; Schedule B: 8533210045, 8533210045|8533210045|8533210045|8533210045|8533210045; Tolerance: 1%; Width: 500µm; Working Voltage: 50V; ComponentLink1URL: https://datasheet.octopart.com:443/AC0402FR-0722K1L-Yageo-datasheet-182189377.pdf?src-supplier=IHS; ComponentLink1Description: https://datasheet.octopart.com:443/AC0402FR-0722K1L-Yageo-datasheet-182189377.pdf?src-supplier=IHS; ComponentLink2URL: https://datasheet.octopart.com:443/AC0402FR-0722K1L-Yageo-datasheet-83209224.pdf?src-supplier=Upverter; ComponentLink2Description: https://datasheet.octopart.com:443/AC0402FR-0722K1L-Yageo-datasheet-83209224.pdf?src-supplier=Upverter; ComponentLink3URL: https://datasheet.octopart.com:443/AC0402FR-0722K1L-Yageo-datasheet-178509465.pdf?src-supplier=Newark; ComponentLink3Description: https://datasheet.octopart.com:443/AC0402FR-0722K1L-Yageo-datasheet-178509465.pdf?src-supplier=Newark; ComponentLink4URL: https://datasheet.octopart.com:443/AC0402FR-0722K1L-Yageo-datasheet-166720450.pdf?src-supplier=Future+Electronics; ComponentLink4Description: https://datasheet.octopart.com:443/AC0402FR-0722K1L-Yageo-datasheet-166720450.pdf?src-supplier=Future+Electronics; ComponentLink5URL: https://datasheet.octopart.com:443/AC0402FR-0722K1L-Yageo-datasheet-151884373.pdf?src-supplier=Future+Electronics; ComponentLink5Description: https://datasheet.octopart.com:443/AC0402FR-0722K1L-Yageo-datasheet-151884373.pdf?src-supplier=Future+Electronics; ComponentLink6URL: https://datasheet.octopart.com:443/AC0402FR-0722K1L-Yageo-datasheet-137699919.pdf?src-supplier=Future+Electronics; ComponentLink6Description: https://datasheet.octopart.com:443/AC0402FR-0722K1L-Yageo-datasheet-137699919.pdf?src-supplier=Future+Electronics; ComponentLink7URL: https://datasheet.octopart.com:443/AC0402FR-0722K1L-Yageo-datasheet-86786639.pdf?src-supplier=Future+Electronics; ComponentLink7Description: https://datasheet.octopart.com:443/AC0402FR-0722K1L-Yageo-datasheet-86786639.pdf?src-supplier=Future+Electronics; ComponentLink8URL: https://datasheet.octopart.com:443/AC0402FR-0722K1L-Yageo-datasheet-128677973.pdf?src-supplier=X-ON; ComponentLink8Description: https://datasheet.octopart.com:443/AC0402FR-0722K1L-Yageo-datasheet-128677973.pdf?src-supplier=X-ON; ComponentLink9URL: https://datasheet.octopart.com/AC0402FR-0722K1L-Yageo-datasheet-12512238.pdf; ComponentLink9Description: https://datasheet.octopart.com/AC0402FR-0722K1L-Yageo-datasheet-12512238.pdf; ComponentLink10URL: http://sigma.octopart.com:80/rohs_statement/Yageo-company-2.pdf?src-supplier=Compliance+Statements; ComponentLink10Description: http://sigma.octopart.com:80/rohs_statement/Yageo-company-2.pdf?src-supplier=Compliance+Statements; ComponentLink11URL: http://sigma.octopart.com:80/conflict_mineral_statement/Yageo-company-3.pdf?src-supplier=Compliance+Statements; ComponentLink11Description: http://sigma.octopart.com:80/conflict_mineral_statement/Yageo-company-3.pdf?src-supplier=Compliance+Statements; LCSC PART NUMBER: C226356
R9 = RC0402JR-072KL: RES 2K OHM 5% 1/16W 0402; Manufacturer: Yageo Group; Power Dissipation: 62.5mW; Value: 2kΩ; Temperature Coefficient: 100ppm/°C; Voltage Rating: 50V; Supplier: DigiKey; Supplier Part Number: 311-2.0KJRCT-ND; Manufacturer Part Number: RC0402JR-072KL; RoHS: Compliant; Category: Chip SMD Resistors; Stock: 102655; Pricing: 1=0.1, 10=0.006, 25=0.0056, 50=0.0052, 100=0.0046, 250=0.00416, 500=0.00284 (USD); Case/Package: 0402; Case Code (Imperial): 0402; China RoHS: Non-Compliant; Composition: Thick Film; Contact Plating: Tin; Depth: 500µm; Height: 350µm; Lead Free: Lead Free; Length: 1mm; Lifecycle Status: Production; Max Operating Temperature: 155°C; Military Standard: Not; Min Operating Temperature: -55°C; Mounting Technology: Surface Mount; Pins: 2; Number of Terminals: 2; Packaging: Tape & Reel; Power Rating: 62.5mW; Radiation Hardening: No; REACH SVHC: Yes; Schedule B: 8533210045, 8533210045|8533210045|8533210045|8533210045|8533210045; Termination: SMD/SMT; Tolerance: 5%; Voltage Rating (DC): 50V; Width: 500µm; Working Voltage: 50V; ComponentLink1URL: https://datasheet.octopart.com:443/RC0402JR-072KL-Yageo-datasheet-175887523.pdf?src-supplier=Newark; ComponentLink1Description: https://datasheet.octopart.com:443/RC0402JR-072KL-Yageo-datasheet-175887523.pdf?src-supplier=Newark; ComponentLink2URL: https://datasheet.octopart.com:443/RC0402JR-072KL-Yageo-datasheet-10408619.pdf?src-supplier=Farnell; ComponentLink2Description: https://datasheet.octopart.com:443/RC0402JR-072KL-Yageo-datasheet-10408619.pdf?src-supplier=Farnell; ComponentLink3URL: https://datasheet.octopart.com:443/RC0402JR-072KL-Yageo-datasheet-62067350.pdf?src-supplier=Farnell; ComponentLink3Description: https://datasheet.octopart.com:443/RC0402JR-072KL-Yageo-datasheet-62067350.pdf?src-supplier=Farnell; ComponentLink4URL: https://datasheet.octopart.com:443/RC0402JR-072KL-Yageo-datasheet-164759695.pdf?src-supplier=Future+Electronics; ComponentLink4Description: https://datasheet.octopart.com:443/RC0402JR-072KL-Yageo-datasheet-164759695.pdf?src-supplier=Future+Electronics; ComponentLink5URL: https://datasheet.octopart.com:443/RC0402JR-072KL-Yageo-datasheet-137700087.pdf?src-supplier=Future+Electronics; ComponentLink5Description: https://datasheet.octopart.com:443/RC0402JR-072KL-Yageo-datasheet-137700087.pdf?src-supplier=Future+Electronics; ComponentLink6URL: https://datasheet.octopart.com:443/RC0402JR-072KL-Yageo-datasheet-12531192.pdf?src-supplier=Future+Electronics; ComponentLink6Description: https://datasheet.octopart.com:443/RC0402JR-072KL-Yageo-datasheet-12531192.pdf?src-supplier=Future+Electronics; ComponentLink7URL: https://datasheet.octopart.com:443/RC0402JR-072KL-Yageo-datasheet-505231.pdf?src-supplier=Future+Electronics; ComponentLink7Description: https://datasheet.octopart.com:443/RC0402JR-072KL-Yageo-datasheet-505231.pdf?src-supplier=Future+Electronics; ComponentLink8URL: https://datasheet.octopart.com/RC0402JR-072KL-Yageo-datasheet-73766026.pdf; ComponentLink8Description: https://datasheet.octopart.com/RC0402JR-072KL-Yageo-datasheet-73766026.pdf; ComponentLink9URL: https://datasheet.octopart.com:443/RC0402JR-072KL-Yageo-datasheet-8329306.pdf?src-supplier=element14; ComponentLink9Description: https://datasheet.octopart.com:443/RC0402JR-072KL-Yageo-datasheet-8329306.pdf?src-supplier=element14; ComponentLink10URL: https://datasheet.octopart.com:443/RC0402JR-072KL-Yageo-datasheet-8324527.pdf?src-supplier=TME; ComponentLink10Description: https://datasheet.octopart.com:443/RC0402JR-072KL-Yageo-datasheet-8324527.pdf?src-supplier=TME; ComponentLink11URL: http://sigma.octopart.com:80/rohs_statement/Yageo-company-2.pdf?src-supplier=Compliance+Statements; ComponentLink11Description: http://sigma.octopart.com:80/rohs_statement/Yageo-company-2.pdf?src-supplier=Compliance+Statements; ComponentLink12URL: http://sigma.octopart.com:80/conflict_mineral_statement/Yageo-company-3.pdf?src-supplier=Compliance+Statements; ComponentLink12Description: http://sigma.octopart.com:80/conflict_mineral_statement/Yageo-company-3.pdf?src-supplier=Compliance+Statements; LCSC PART NUMBER: C137887
R10 = RC0402FR-1347K5L: RES 47.5K OHM 1% 1/16W 0402; Manufacturer: Yageo Group; Power Dissipation: 62.5mW; Value: 47.5kΩ; Temperature Coefficient: 100ppm/°C; Working Voltage: 50V; Supplier: DigiKey; Supplier Part Number: 13-RC0402FR-1347K5LCT-ND; Manufacturer Part Number: RC0402FR-1347K5L; RoHS: Compliant; Category: Chip SMD Resistors; Stock: 75939; Pricing: 1=0.1, 10=0.02, 25=0.014, 50=0.0112, 100=0.009, 250=0.00688, 500=0.00566, 1000=0.00474, 5000=0.00328 (USD); Case/Package: 0402; China RoHS: Non-Compliant; Composition: Thick Film; Contact Plating: Tin; Depth: 500µm; Height: 350µm; Length: 1mm; Lifecycle Status: Production; Max Operating Temperature: 155°C; Military Standard: Not; Min Operating Temperature: -55°C; Mounting Technology: Surface Mount; Number of Terminals: 2; REACH SVHC: Yes; Tolerance: 1%; Width: 500µm; ComponentLink1URL: https://datasheet.octopart.com:443/RC0402FR-1347K5L-Yageo-datasheet-175887523.pdf?src-supplier=IHS; ComponentLink1Description: https://datasheet.octopart.com:443/RC0402FR-1347K5L-Yageo-datasheet-175887523.pdf?src-supplier=IHS; ComponentLink2URL: https://datasheet.octopart.com:443/RC0402FR-1347K5L-Yageo-Group-datasheet-189192902.pdf?src-supplier=TME; ComponentLink2Description: https://datasheet.octopart.com:443/RC0402FR-1347K5L-Yageo-Group-datasheet-189192902.pdf?src-supplier=TME; ComponentLink3URL: https://datasheet.octopart.com:443/RC0402FR-1347K5L-Yageo-Group-datasheet-176638170.pdf?src-supplier=TME; ComponentLink3Description: https://datasheet.octopart.com:443/RC0402FR-1347K5L-Yageo-Group-datasheet-176638170.pdf?src-supplier=TME; ComponentLink4URL: https://datasheet.octopart.com/RC0402FR-1347K5L-Yageo-datasheet-73766026.pdf; ComponentLink4Description: https://datasheet.octopart.com/RC0402FR-1347K5L-Yageo-datasheet-73766026.pdf; ComponentLink5URL: https://datasheet.octopart.com:443/RC0402FR-1347K5L-Yageo-datasheet-10408619.pdf?src-supplier=_legacy+Avnet; ComponentLink5Description: https://datasheet.octopart.com:443/RC0402FR-1347K5L-Yageo-datasheet-10408619.pdf?src-supplier=_legacy+Avnet; ComponentLink6URL: http://sigma.octopart.com:80/conflict_mineral_statement/Yageo-company-3.pdf?src-supplier=Compliance+Statements; ComponentLink6Description: http://sigma.octopart.com:80/conflict_mineral_statement/Yageo-company-3.pdf?src-supplier=Compliance+Statements; ComponentLink7URL: http://sigma.octopart.com:80/rohs_statement/Yageo-company-2.pdf?src-supplier=Compliance+Statements; ComponentLink7Description: http://sigma.octopart.com:80/rohs_statement/Yageo-company-2.pdf?src-supplier=Compliance+Statements; LCSC PART NUMBER: C106235
R14 = RC0402JR-0747KL: RES 4.7K OHM 5% 1/16W 0402; Manufacturer: Yageo Group; Max Power Dissipation: 63mW; Power Dissipation: 62.5mW; Value: 47kΩ; Temperature Coefficient: 100ppm/°C; Voltage Rating: 50V; Supplier: DigiKey; Supplier Part Number: 311-47KJRCT-ND; Manufacturer Part Number: RC0402JR-0747KL; RoHS: Compliant; Category: Chip SMD Resistors; Stock: 272791; Pricing: 1=0.1, 10=0.006, 25=0.0044, 50=0.003, 100=0.0028 (USD); Case/Package: 0402; Case Code (Imperial): 0402; China RoHS: Non-Compliant; Composition: Thick Film; Depth: 500µm; Features: Moisture Resistant; Height: 350µm; Lead Free: Lead Free; Length: 1mm; Lifecycle Status: Production; Max Operating Temperature: 155°C; Military Standard: Not; Min Operating Temperature: -55°C; Mounting Technology: Surface Mount; Pins: 2; Number of Terminals: 2; Number of Terminations: 2; Packaging: Tape & Reel; Power Rating: 63mW; REACH SVHC: Yes; Schedule B: 8533210045, 8533210045|8533210045, 8533210045|8533210045|8533210045, 8533210045|8533210045|8533210045|8533210045; Termination: SMD/SMT; Tolerance: 5%; Voltage Rating (AC): 50V; Voltage Rating (DC): 50V; Width: 500µm; Working Voltage: 50V; ComponentLink1URL: https://datasheet.octopart.com:443/RC0402JR-0747KL-Yageo-datasheet-175887523.pdf?src-supplier=IHS; ComponentLink1Description: https://datasheet.octopart.com:443/RC0402JR-0747KL-Yageo-datasheet-175887523.pdf?src-supplier=IHS; ComponentLink2URL: https://datasheet.octopart.com:443/RC0402JR-0747KL-Yageo-datasheet-10408619.pdf?src-supplier=Newark; ComponentLink2Description: https://datasheet.octopart.com:443/RC0402JR-0747KL-Yageo-datasheet-10408619.pdf?src-supplier=Newark; ComponentLink3URL: https://datasheet.octopart.com:443/RC0402JR-0747KL-Yageo-datasheet-8324527.pdf?src-supplier=Newark; ComponentLink3Description: https://datasheet.octopart.com:443/RC0402JR-0747KL-Yageo-datasheet-8324527.pdf?src-supplier=Newark; ComponentLink4URL: https://datasheet.octopart.com:443/RC0402JR-0747KL-Yageo-datasheet-98239111.pdf?src-supplier=Upverter; ComponentLink4Description: https://datasheet.octopart.com:443/RC0402JR-0747KL-Yageo-datasheet-98239111.pdf?src-supplier=Upverter; ComponentLink5URL: https://datasheet.octopart.com:443/RC0402JR-0747KL-Yageo-datasheet-62067350.pdf?src-supplier=element14+APAC; ComponentLink5Description: https://datasheet.octopart.com:443/RC0402JR-0747KL-Yageo-datasheet-62067350.pdf?src-supplier=element14+APAC; ComponentLink6URL: https://datasheet.octopart.com:443/RC0402JR-0747KL-Yageo-datasheet-176638170.pdf?src-supplier=JRH+Electronics; ComponentLink6Description: https://datasheet.octopart.com:443/RC0402JR-0747KL-Yageo-datasheet-176638170.pdf?src-supplier=JRH+Electronics; ComponentLink7URL: https://datasheet.octopart.com:443/RC0402JR-0747KL-Yageo-datasheet-164759695.pdf?src-supplier=Future+Electronics; ComponentLink7Description: https://datasheet.octopart.com:443/RC0402JR-0747KL-Yageo-datasheet-164759695.pdf?src-supplier=Future+Electronics; ComponentLink8URL: https://datasheet.octopart.com:443/RC0402JR-0747KL-Yageo-datasheet-137700087.pdf?src-supplier=Future+Electronics; ComponentLink8Description: https://datasheet.octopart.com:443/RC0402JR-0747KL-Yageo-datasheet-137700087.pdf?src-supplier=Future+Electronics; ComponentLink9URL: https://datasheet.octopart.com:443/RC0402JR-0747KL-Yageo-datasheet-12531192.pdf?src-supplier=Future+Electronics; ComponentLink9Description: https://datasheet.octopart.com:443/RC0402JR-0747KL-Yageo-datasheet-12531192.pdf?src-supplier=Future+Electronics; ComponentLink10URL: https://datasheet.octopart.com:443/RC0402JR-0747KL-Yageo-datasheet-8324255.pdf?src-supplier=Future+Electronics; ComponentLink10Description: https://datasheet.octopart.com:443/RC0402JR-0747KL-Yageo-datasheet-8324255.pdf?src-supplier=Future+Electronics; ComponentLink11URL: https://datasheet.octopart.com:443/RC0402JR-0747KL-Yageo-datasheet-148775077.pdf?src-supplier=TME; ComponentLink11Description: https://datasheet.octopart.com:443/RC0402JR-0747KL-Yageo-datasheet-148775077.pdf?src-supplier=TME; ComponentLink12URL: https://datasheet.octopart.com/RC0402JR-0747KL-Yageo-datasheet-73766026.pdf; ComponentLink12Description: https://datasheet.octopart.com/RC0402JR-0747KL-Yageo-datasheet-73766026.pdf; ComponentLink13URL: https://datasheet.octopart.com:443/RC0402JR-0747KL-Yageo-datasheet-8329306.pdf?src-supplier=element14; ComponentLink13Description: https://datasheet.octopart.com:443/RC0402JR-0747KL-Yageo-datasheet-8329306.pdf?src-supplier=element14; ComponentLink14URL: http://sigma.octopart.com:80/rohs_statement/Yageo-company-2.pdf?src-supplier=Compliance+Statements; ComponentLink14Description: http://sigma.octopart.com:80/rohs_statement/Yageo-company-2.pdf?src-supplier=Compliance+Statements; ComponentLink15URL: http://sigma.octopart.com:80/conflict_mineral_statement/Yageo-company-3.pdf?src-supplier=Compliance+Statements; ComponentLink15Description: http://sigma.octopart.com:80/conflict_mineral_statement/Yageo-company-3.pdf?src-supplier=Compliance+Statements; LCSC PART NUMBER: C105870